# Altium project BLDC_4.PrjPcb
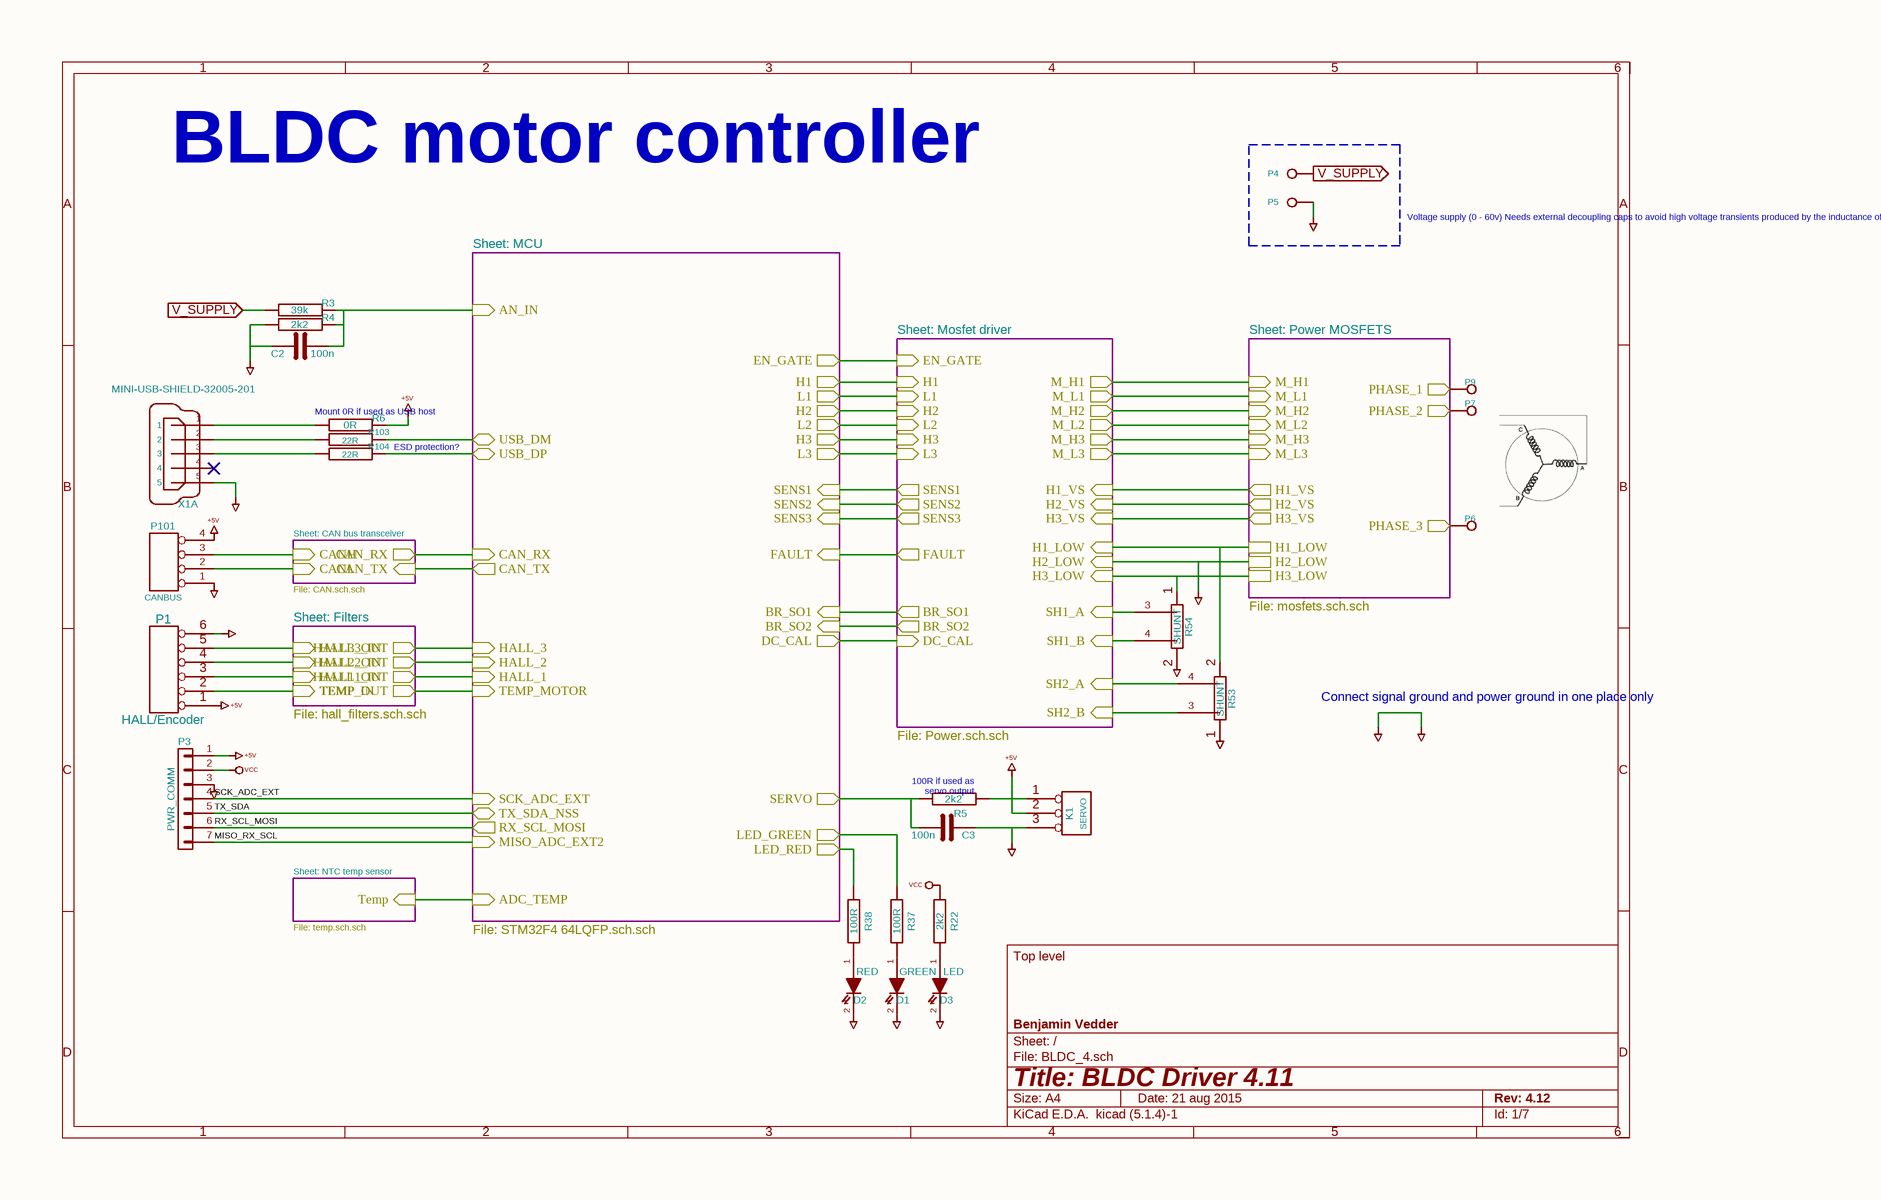
[diagram p0: BLDC_4.SchDoc]
7 sheets, 26 parts. Net scope: hierarchical (ports join the sheet entries above them; power ports are global).
Board files: BLDC_4.PcbDoc, BLDC_4(1).PcbDoc, BLDC_4(2).PcbDoc
Sheets:
  BLDC_4.SchDoc
    Power MOSFETS = mosfets.SchDoc
    NTC temp sensor = temp.SchDoc
    CAN bus transceiver = CAN.SchDoc
    Filters = hall_filters.SchDoc
    MCU = STM32F4 64LQFP.SchDoc
    Mosfet driver = Power.SchDoc

## Sheet BLDC_4.SchDoc
size 297 x 210 mm

### Parts
C2  100n  [SMD-0603_c]
C3  100n  [SMD-0603_c]
D1  GREEN  [LED-0603]
D2  RED  [LED-0603]
D3  LED  [LED-0603]
K1  SERVO  [pinhead-1X03]
P1  HALL/Encoder  [MICRO_JST_6]
P3  PWR_COMM  [b7b-ph-kl]
P4  IN+  [1PAD_4x5mm]  (value not drawn)
P5  IN-  [1PAD_4x5mm]  (value not drawn)
P6  MOTOR1  [1PAD_4x5mm]  (value not drawn)
P7  MOTOR2  [1PAD_4x5mm]  (value not drawn)
P9  MOTOR3  [1PAD_4x5mm]  (value not drawn)
P101  CANBUS  [b4b-ph-kl]
R3  39k  [SMD-0603_r]
R4  2k2  [SMD-0603_r]
R5  2k2  [SMD-0603_r]
R6  0R  [SMD-0603_r]
R22  2k2  [SMD-0603_r]
R37  100R  [SMD-0603_r]
R38  100R  [SMD-0603_r]
R53  SHUNT  [WSLP2726]
R54  SHUNT  [WSLP2726]
R103  22R  [SMD-0603_r]
R104  22R  [SMD-0603_r]
X1  MINI-USB-SHIELD-32005-201  [USB-UX60R-MB-5ST]  (part A of 2)

### Sub-sheets
CAN bus transceiver = CAN.SchDoc: CAN_RX (out), CAN_TX (in), CANH (in), CANL (in)
Filters = hall_filters.SchDoc: HALL3_IN (in), HALL2_IN (in), HALL1_IN (in), TEMP_IN (in), HALL3_OUT (out), HALL2_OUT (out), HALL1_OUT (out), TEMP_OUT (out)
MCU = STM32F4 64LQFP.SchDoc: USB_DM (bidir), USB_DP (bidir), SERVO (out), HALL_1 (in), HALL_2 (in), HALL_3 (in), TEMP_MOTOR (in), L3 (out), L2 (out), L1 (out), FAULT (in), H3 (out), H2 (out), H1 (out), SENS3 (in), SENS2 (in), SENS1 (in), BR_SO1 (in), BR_SO2 (in), AN_IN (in), EN_GATE (out), DC_CAL (out), CAN_RX (in), CAN_TX (out), LED_RED (out), LED_GREEN (out), ADC_TEMP (in), SCK_ADC_EXT (in), MISO_ADC_EXT2 (in), RX_SCL_MOSI (out), TX_SDA_NSS (bidir)
Mosfet driver = Power.SchDoc: FAULT (out), DC_CAL (in), EN_GATE (in), H1 (in), L1 (in), H2 (in), L2 (in), H3 (in), L3 (in), BR_SO1 (out), BR_SO2 (out), SENS1 (out), SENS2 (out), SENS3 (out), M_H1 (out), M_L1 (out), H1_LOW (in), M_H2 (out), M_L2 (out), H2_LOW (in), M_H3 (out), M_L3 (out), H3_LOW (in), H1_VS (in), H2_VS (in), H3_VS (in), SH1_A (in), SH1_B (in), SH2_A (in), SH2_B (in)
NTC temp sensor = temp.SchDoc: Temp (in)
Power MOSFETS = mosfets.SchDoc: M_H1 (in), M_L1 (in), H1_VS (out), M_H2 (in), M_L2 (in), H2_VS (out), H1_LOW, H2_LOW, H3_LOW, H3_VS (out), M_H3 (in), M_L3 (in), PHASE_1 (out), PHASE_2 (out), PHASE_3 (out)

### Ports
V_SUPPLY (in)

### Nets
+5V: K1.2(PM) P1.1 P3.1(P1) P101.4(P4) R6.2
GND: C2.1 C3.1 D1.2(K) D2.2(K) D3.2(K) K1.3(P3) P1.6 P3.3(P3) P5.1 P101.1(P1) R4.1 R53.1 R54.2 X1.5 ; sheet Power MOSFETS/H2_LOW, sheet Mosfet driver/H2_LOW
VCC: P3.2(P2) R22.2
ADC_TEMP: sheet NTC temp sensor/Temp, sheet MCU/ADC_TEMP
AN_IN: C2.2 R3.2 R4.2 ; sheet MCU/AN_IN
BR_SO1: sheet MCU/BR_SO1, sheet Mosfet driver/BR_SO1
BR_SO2: sheet MCU/BR_SO2, sheet Mosfet driver/BR_SO2
CAN_RX: sheet CAN bus transceiver/CAN_RX, sheet MCU/CAN_RX
CAN_TX: sheet CAN bus transceiver/CAN_TX, sheet MCU/CAN_TX
CANH: P101.3(P3) ; sheet CAN bus transceiver/CANH
CANL: P101.2(P2) ; sheet CAN bus transceiver/CANL
DC_CAL: sheet MCU/DC_CAL, sheet Mosfet driver/DC_CAL
EN_GATE: sheet MCU/EN_GATE, sheet Mosfet driver/EN_GATE
FAULT: sheet MCU/FAULT, sheet Mosfet driver/FAULT
H1: sheet MCU/H1, sheet Mosfet driver/H1
H1_LOW: R53.2 ; sheet Power MOSFETS/H1_LOW, sheet Mosfet driver/H1_LOW
H1_VS: P9.1 ; sheet Power MOSFETS/H1_VS, sheet Power MOSFETS/PHASE_1, sheet Mosfet driver/H1_VS
H2: sheet MCU/H2, sheet Mosfet driver/H2
H2_VS: P7.1 ; sheet Power MOSFETS/H2_VS, sheet Power MOSFETS/PHASE_2, sheet Mosfet driver/H2_VS
H3: sheet MCU/H3, sheet Mosfet driver/H3
H3_LOW: R54.1 ; sheet Power MOSFETS/H3_LOW, sheet Mosfet driver/H3_LOW
H3_VS: P6.1 ; sheet Power MOSFETS/H3_VS, sheet Power MOSFETS/PHASE_3, sheet Mosfet driver/H3_VS
HALL1_IN: P1.3 ; sheet Filters/HALL1_IN
HALL1_OUT: sheet Filters/HALL1_OUT, sheet MCU/HALL_1
HALL2_IN: P1.4 ; sheet Filters/HALL2_IN
HALL2_OUT: sheet Filters/HALL2_OUT, sheet MCU/HALL_2
HALL3_IN: P1.5 ; sheet Filters/HALL3_IN
HALL3_OUT: sheet Filters/HALL3_OUT, sheet MCU/HALL_3
L1: sheet MCU/L1, sheet Mosfet driver/L1
L2: sheet MCU/L2, sheet Mosfet driver/L2
L3: sheet MCU/L3, sheet Mosfet driver/L3
LED_GREEN: R37.2 ; sheet MCU/LED_GREEN
LED_RED: R38.2 ; sheet MCU/LED_RED
M_H1: sheet Power MOSFETS/M_H1, sheet Mosfet driver/M_H1
M_H2: sheet Power MOSFETS/M_H2, sheet Mosfet driver/M_H2
M_H3: sheet Power MOSFETS/M_H3, sheet Mosfet driver/M_H3
M_L1: sheet Power MOSFETS/M_L1, sheet Mosfet driver/M_L1
M_L2: sheet Power MOSFETS/M_L2, sheet Mosfet driver/M_L2
M_L3: sheet Power MOSFETS/M_L3, sheet Mosfet driver/M_L3
MISO_RX_SCL: P3.7(P7) ; sheet MCU/MISO_ADC_EXT2
RX_SCL_MOSI: P3.6(P6) ; sheet MCU/RX_SCL_MOSI
SCK_ADC_EXT: P3.4(P4) ; sheet MCU/SCK_ADC_EXT
SENS1: sheet MCU/SENS1, sheet Mosfet driver/SENS1
SENS2: sheet MCU/SENS2, sheet Mosfet driver/SENS2
SENS3: sheet MCU/SENS3, sheet Mosfet driver/SENS3
SERVO: C3.2 R5.1 ; sheet MCU/SERVO
SH1_A: R54.3 ; sheet Mosfet driver/SH1_A
SH1_B: R54.4 ; sheet Mosfet driver/SH1_B
SH2_A: R53.4 ; sheet Mosfet driver/SH2_A
SH2_B: R53.3 ; sheet Mosfet driver/SH2_B
TEMP_MOTOR: P1.2 ; sheet Filters/TEMP_IN, sheet Filters/TEMP_OUT, sheet MCU/TEMP_MOTOR
TX_SDA: P3.5(P5) ; sheet MCU/TX_SDA_NSS
USB_DM: R103.1 ; sheet MCU/USB_DM
USB_DP: R104.1 ; sheet MCU/USB_DP
V_SUPPLY: P4.1 R3.1 ; port V_SUPPLY
NetD1_1: D1.1(A) R37.1
NetD2_1: D2.1(A) R38.1
NetD3_1: D3.1(A) R22.1
NetK1_1: K1.1(P1) R5.2
NetR6_1: R6.1 X1.1
NetR103_2: R103.2 X1.2
NetR104_2: R104.2 X1.3

Not connected (* = marked no-connect by the designer): X1 4*

### Notes on the sheet
- BLDC motor controller
- Voltage supply (0 - 60v)
  Needs external decoupling
  caps to avoid high voltage
  transients produced by the
  inductance of the battery
  wiring while switching the FETs
  Also critical for EMI/RF compliance
- Sheet: MCU
- Sheet: Mosfet driver
- Sheet: Power MOSFETS
- (near R6) Mount 0R if used
  as USB host
- ESD protection?
- Sheet: CAN bus transceiver
- File: CAN.sch.sch
- Sheet: Filters
- File: mosfets.sch.sch
- File: hall_filters.sch.sch
- Connect signal ground and
  power ground in one place only
- File: Power.sch.sch
- (near R5) 100R if used as
  servo output
- File: temp.sch.sch
- Sheet: NTC temp sensor
- File: STM32F4 64LQFP.sch.sch
- 1
- 2
- 3
- 4
- 5
- 6
- A
- B
- C
- Top level
- D
- Title: BLDC Driver 4.11
- File: BLDC_4.sch
- Sheet: /
- Benjamin Vedder
- KiCad E.D.A.  kicad (5.1.4)-1
- Size: A4
- Date: 21 aug 2015
- Rev: 4.12
- Id: 1/7

### Library data of the parts
C2 C3 = C-RESCUE-BLDC_4: Value: 100n; Footprint: CRF1:SMD-0603_c
D1-D3 = LED-RESCUE-BLDC_4: Footprint: LEDs:LED-0603
  D1: Value: GREEN
  D2: Value: RED
  D3: Value: LED
K1 = CONN_3: Value: SERVO; Footprint: CRF1:pinhead-1X03
P1 = CONN_6: Value: HALL/Encoder; Footprint: CRF1:MICRO_JST_6
P3 = CONN_01X07: Value: PWR_COMM; Footprint: CRF1:b7b-ph-kl
P4-P7 P9 = CONN_1: Footprint: CRF1:1PAD_4x5mm
  P4: Value: IN+
  P5: Value: IN-
  P6: Value: MOTOR1
  P7: Value: MOTOR2
  P9: Value: MOTOR3
P101 = CONN_4: Value: CANBUS; Footprint: JST conn:b4b-ph-kl
R3-R6 R22 R37 R38 R103 R104 = R-RESCUE-BLDC_4: Footprint: CRF1:SMD-0603_r
  R3: Value: 39k
  R4 R5 R22: Value: 2k2
  R6: Value: 0R
  R37 R38: Value: 100R
  R103 R104: Value: 22R
X1 = MINI-USB-SCHIELD-32005-201: Value: MINI-USB-SHIELD-32005-201; Footprint: CRF1:USB-UX60R-MB-5ST
R53 R54 = SHUNT: Value: SHUNT; Footprint: CRF1:WSLP2726

## Sheet mosfets.SchDoc
size 297 x 210 mm
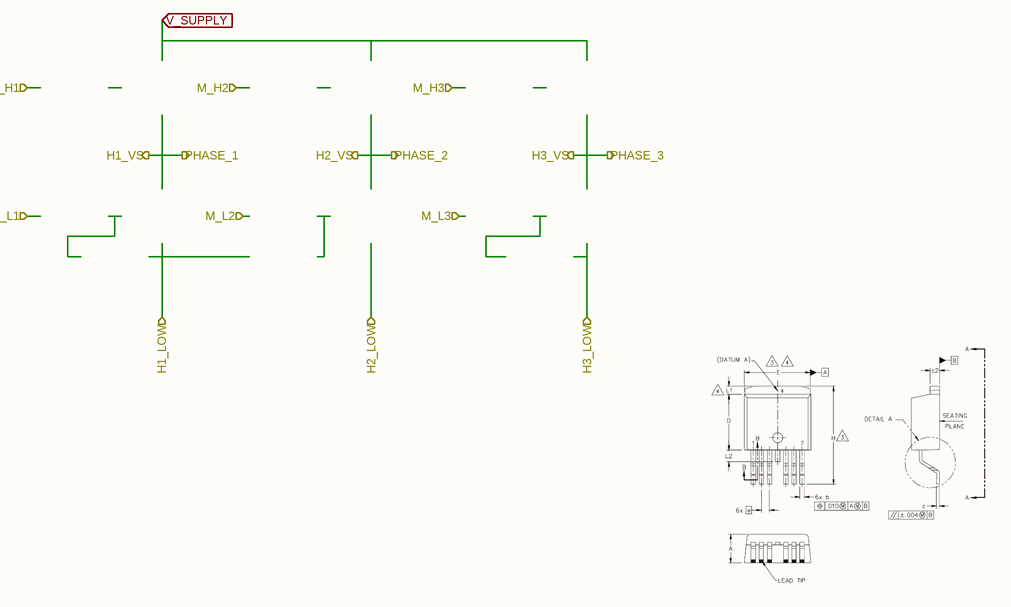
[diagram p1: mosfets.SchDoc]

### Ports
H1_LOW, H1_VS (out), H2_LOW, H2_VS (out), H3_LOW, H3_VS (out), M_H1 (in), M_H2 (in), M_H3 (in), M_L1 (in), M_L2 (in), M_L3 (in), PHASE_1 (out), PHASE_2 (out), PHASE_3 (out), V_SUPPLY (in)

### Nets
H1_VS: port H1_VS, port PHASE_1
H2_VS: port H2_VS, port PHASE_2
H3_VS: port H3_VS, port PHASE_3

### Notes on the sheet
- 1
- 2
- 3
- 4
- 5
- 6
- A
- B
- C
- D
- Title: BLDC Driver 4.11
- File: mosfets.sch
- Sheet: /
- Benjamin Vedder
- KiCad E.D.A.  kicad (5.1.4)-1
- Size: A4
- Date: 21 aug 2015
- Rev: 4.12
- Id: 2/7

## Sheet temp.SchDoc
size 297 x 210 mm
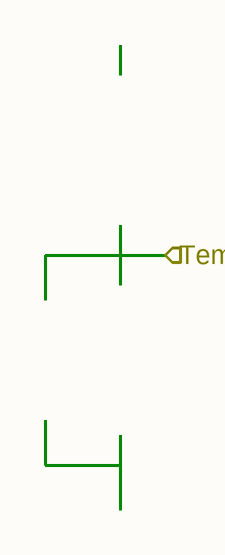
[diagram p2: temp.SchDoc]

### Ports
Temp (in)

### Notes on the sheet
- 1
- 2
- 3
- 4
- 5
- 6
- A
- B
- C
- D
- Title: BLDC Driver 4.11
- File: temp.sch
- Sheet: /
- Benjamin Vedder
- KiCad E.D.A.  kicad (5.1.4)-1
- Size: A4
- Date: 21 aug 2015
- Rev: 4.12
- Id: 3/7

## Sheet CAN.SchDoc
size 297 x 210 mm
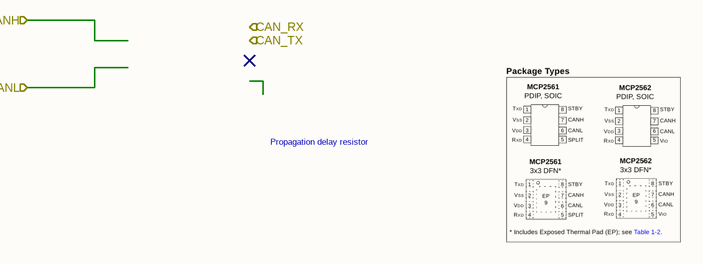
[diagram p3: CAN.SchDoc]

### Ports
CAN_RX (out), CAN_TX (in), CANH (in), CANL (in)

### Notes on the sheet
- Propagation delay
  resistor
- 1
- 2
- 3
- 4
- 5
- 6
- A
- B
- C
- D
- Title: BLDC Driver 4.11
- File: CAN.sch
- Sheet: /
- Benjamin Vedder
- KiCad E.D.A.  kicad (5.1.4)-1
- Size: A4
- Date: 21 aug 2015
- Rev: 4.12
- Id: 4/7

## Sheet hall_filters.SchDoc
size 297 x 210 mm
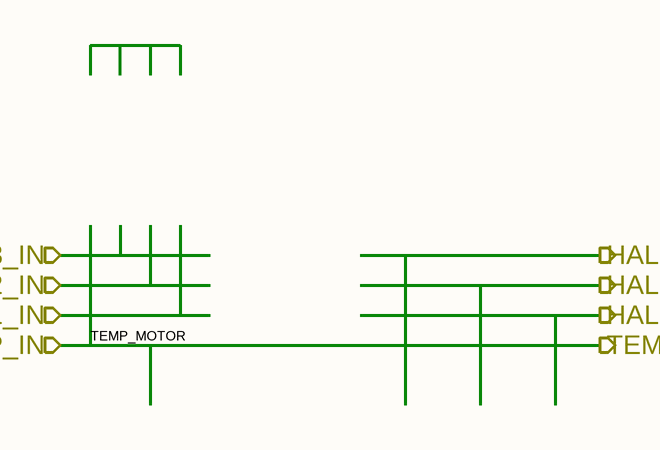
[diagram p4: hall_filters.SchDoc]

### Ports
HALL1_IN (in), HALL1_OUT (out), HALL2_IN (in), HALL2_OUT (out), HALL3_IN (in), HALL3_OUT (out), TEMP_IN (in), TEMP_OUT (out)

### Nets
TEMP_MOTOR: port TEMP_IN, port TEMP_OUT

### Notes on the sheet
- 1
- 2
- 3
- 4
- 5
- 6
- A
- B
- C
- D
- Title: BLDC Driver 4.11
- File: hall_filters.sch
- Sheet: /
- Benjamin Vedder
- KiCad E.D.A.  kicad (5.1.4)-1
- Size: A4
- Date: 21 aug 2015
- Rev: 4.12
- Id: 5/7

## Sheet STM32F4 64LQFP.SchDoc
size 297 x 210 mm
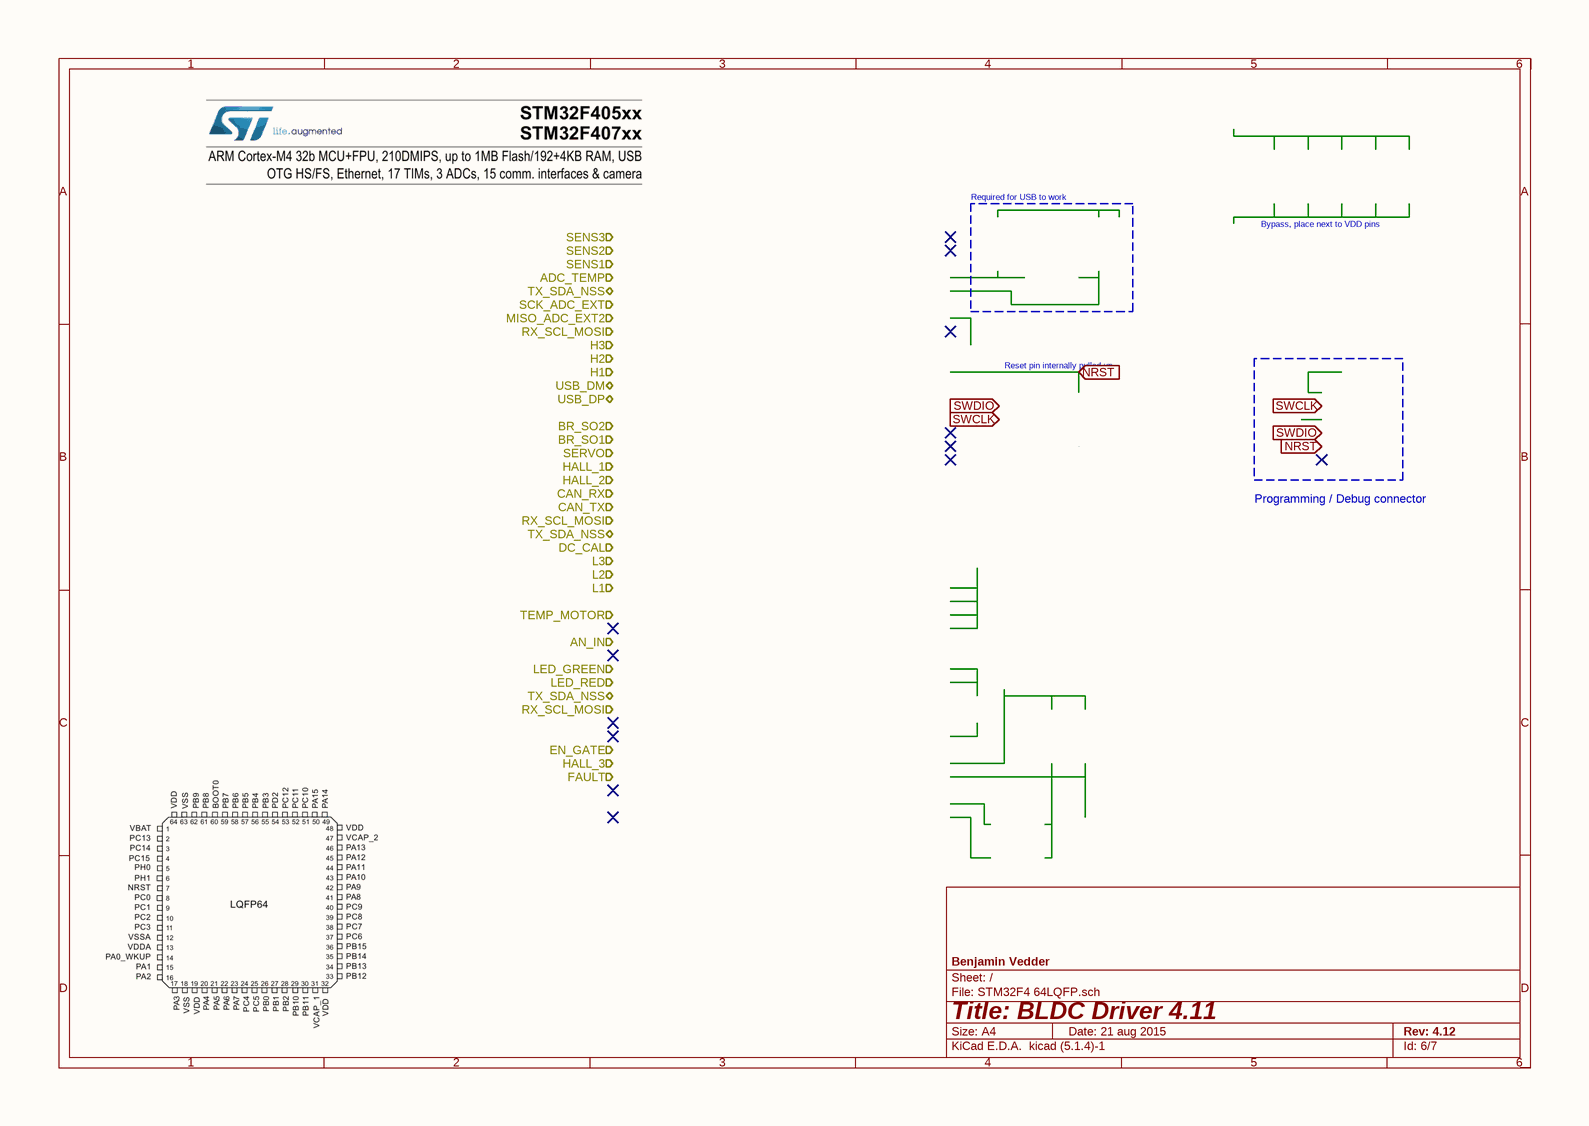
[diagram p5: STM32F4 64LQFP.SchDoc]

### Ports
ADC_TEMP (in), AN_IN (in), BR_SO1 (in), BR_SO2 (in), CAN_RX (in), CAN_TX (out), DC_CAL (in), EN_GATE (out), FAULT (in), H1 (out), H2 (out), H3 (out), HALL_1 (in), HALL_2 (in), HALL_3 (in), L1 (out), L2 (out), L3 (out), LED_GREEN (out), LED_RED (out), MISO_ADC_EXT2 (in), NRST (in), RX_SCL_MOSI (out), SCK_ADC_EXT (in), SENS1 (in), SENS2 (in), SENS3 (in), SERVO (out), SWCLK (in), SWDIO (in), TEMP_MOTOR (in), TX_SDA_NSS (bidir), USB_DM (bidir), USB_DP (bidir)

### Notes on the sheet
- Required for USB
  to work
- Bypass, place next to VDD pins
- Reset pin internally
  pulled up
- Programming / Debug
  connector
- 1
- 2
- 3
- 4
- 5
- 6
- A
- B
- C
- D
- Title: BLDC Driver 4.11
- File: STM32F4 64LQFP.sch
- Sheet: /
- Benjamin Vedder
- KiCad E.D.A.  kicad (5.1.4)-1
- Size: A4
- Date: 21 aug 2015
- Rev: 4.12
- Id: 6/7

## Sheet Power.SchDoc
size 297 x 210 mm
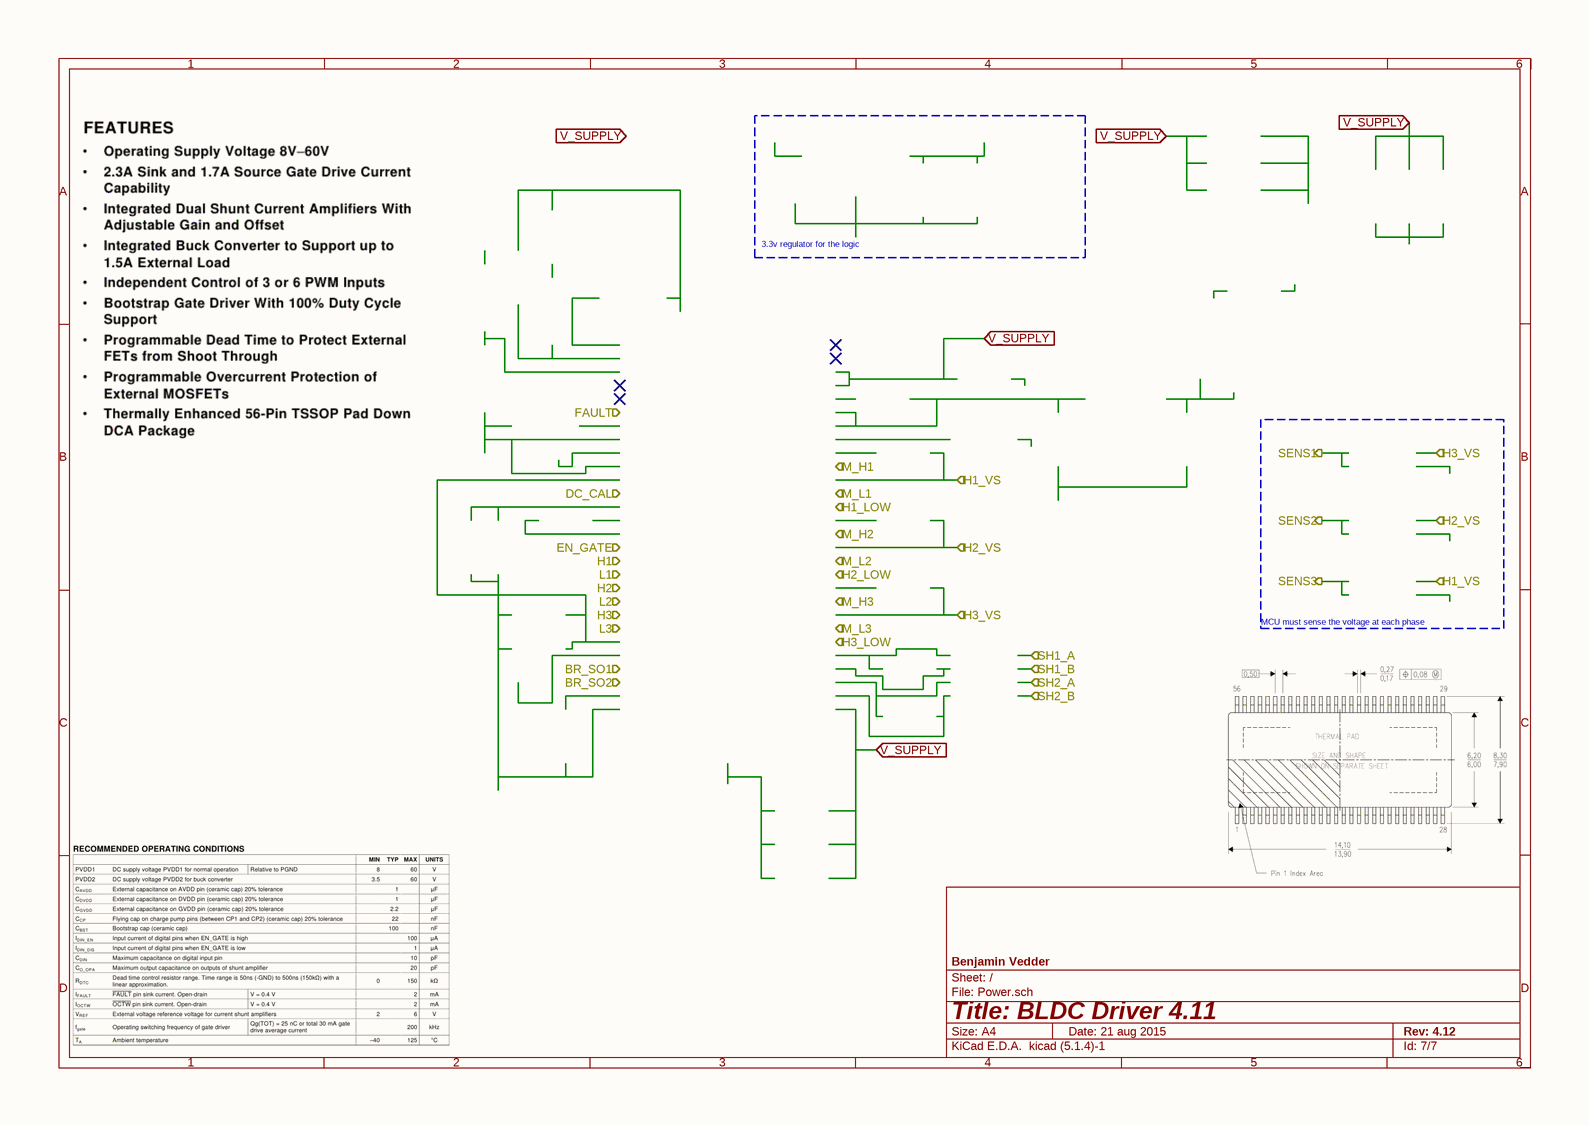
[diagram p6: Power.SchDoc]

### Ports
BR_SO1 (out), BR_SO2 (out), DC_CAL (in), EN_GATE (in), FAULT (out), H1 (in), H1_LOW (in), H1_VS (in), H2 (in), H2_LOW (in), H2_VS (in), H3 (in), H3_LOW (in), H3_VS (in), L1 (in), L2 (in), L3 (in), M_H1 (out), M_H2 (out), M_H3 (out), M_L1 (out), M_L2 (out), M_L3 (out), SENS1 (out), SENS2 (out), SENS3 (out), SH1_A (in), SH1_B (in), SH2_A (in), SH2_B (in), V_SUPPLY (in)

### Notes on the sheet
- 3.3v regulator
  for the logic
- MCU must sense the
  voltage at each phase
- 1
- 2
- 3
- 4
- 5
- 6
- A
- B
- C
- D
- Title: BLDC Driver 4.11
- File: Power.sch
- Sheet: /
- Benjamin Vedder
- KiCad E.D.A.  kicad (5.1.4)-1
- Size: A4
- Date: 21 aug 2015
- Rev: 4.12
- Id: 7/7